# EAGLE schematic Trial_1_ECE411_Group_15_UPDATED (1) (EAGLE 9.2.1)
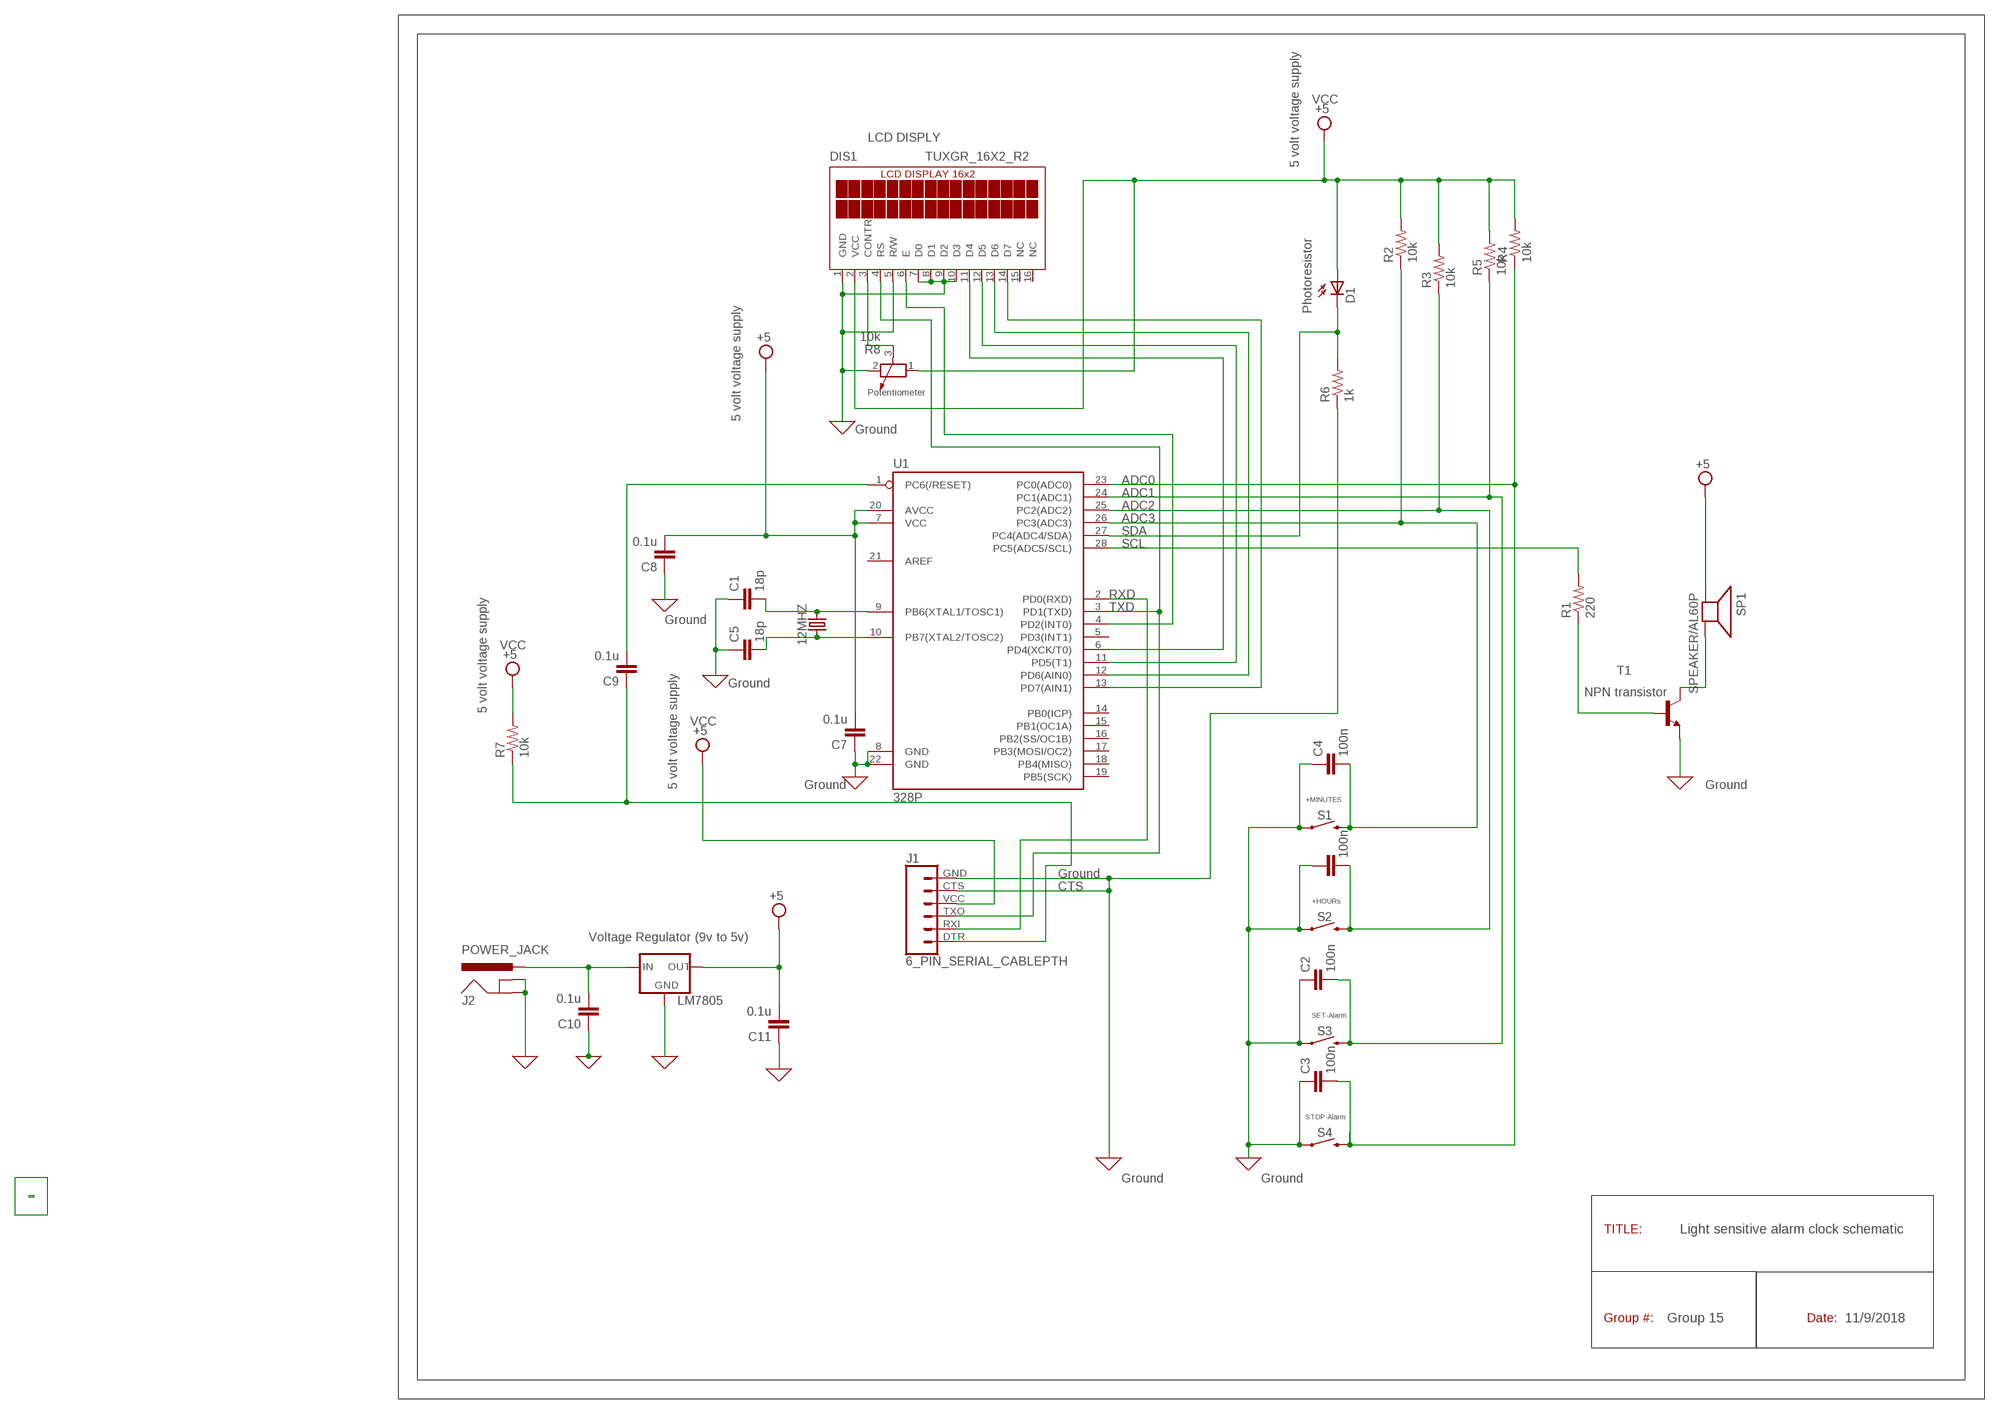
[diagram p0: schematic, sheet 1]

## Parts
12MHZ  CRYSTALPTH-2X6  [CRYSTAL-PTH-2X6-CYL]
C1  18p  C2,5-3  [C2.5-3]
C2  100n  C2,5-3  [C2.5-3]
C3  100n  C2,5-3  [C2.5-3]
C4  100n  C2,5-3  [C2.5-3]
C5  18p  C2,5-3  [C2.5-3]
C6  100n  C2,5-3  [C2.5-3]
C7  0.1u  C2,5-3  [C2.5-3]
C8  0.1u  C2,5-3  [C2.5-3]
C9  0.1u  C2,5-3  [C2.5-3]
C10  0.1u  C2,5-3  [C2.5-3]
C11  0.1u  C2,5-3  [C2.5-3]
D1  BPW32  [BPW32]
DIS1  TUXGR_16X2_R2  [TUXGR_16X2_R2]
J1  6_PIN_SERIAL_CABLEPTH  [FTDI_BASIC]
J2  POWER_JACK  [POWER_JACK_PTH]
LM7805  R-78E5.0-1.0  [DC-DC_CONVERTER_78XX]
R1  220  R-US_0204/2V  [0204V]
R2  10k  R-US_0204/2V  [0204V]
R3  10k  R-US_0204/2V  [0204V]
R4  10k  R-US_0204/2V  [0204V]
R5  10k  R-US_0204/2V  [0204V]
R6  1k  R-US_0204/2V  [0204V]
R7  10k  R-US_0204/2V  [0204V]
R8  10k  POTENTIOMETER_PT-10  [PT-10]
S1  MOMENTARY-SWITCH-SPST-PTH-6.0MM  [TACTILE_SWITCH_PTH_6.0MM]
S2  MOMENTARY-SWITCH-SPST-PTH-6.0MM  [TACTILE_SWITCH_PTH_6.0MM]
S3  MOMENTARY-SWITCH-SPST-PTH-6.0MM  [TACTILE_SWITCH_PTH_6.0MM]
S4  MOMENTARY-SWITCH-SPST-PTH-6.0MM  [TACTILE_SWITCH_PTH_6.0MM]
SP1  SPEAKER/AL60P  [AL60P]
T1  2N2222  [TO92-EBC-OVAL]
U1  328P  ATMEGA328P_PDIP  [DIP28]

## Nets
0: C1.1 C2.1 C3.1 C4.1 C5.1 C6.1 C7.1 C8.1 C10.1 C11.1 DIS1.1(GND) DIS1.5(R/W) DIS1.7(D0) DIS1.8(D1) DIS1.9(D2) DIS1.10(D3) J1.CTS J1.GND J2.GND J2.GNDBREAK LM7805.GND R6.1 R8.2 S1.1 S2.1 S3.1 S4.1 T1.E U1.8(GND) U1.22(GND) ; supply symbol labelled GND
ADC0: C3.2 R4.1 S4.3 U1.23(PC0(ADC0))
ADC1: C2.2 R5.1 S3.3 U1.24(PC1(ADC1))
ADC2: C6.2 R3.1 S2.3 U1.25(PC2(ADC2))
ADC3: C4.2 R2.1 S1.3 U1.26(PC3(ADC3))
N$1: 12MHZ.2 C1.2 U1.9(PB6(XTAL1/TOSC1))
N$2: 12MHZ.1 C5.2 U1.10(PB7(XTAL2/TOSC2))
N$3: SP1.2(-) T1.C
N$4: R1.1 T1.B
N$6: C10.2 J2.PWR LM7805.VIN(IN)
N$7: J1.RXI U1.2(PD0(RXD))
N$9: DIS1.4(RS) J1.TXO U1.3(PD1(TXD))
N$11: DIS1.3(CONTR) R8.3
N$13: DIS1.11(D4) U1.6(PD4(XCK/T0))
N$14: DIS1.12(D5) U1.11(PD5(T1))
N$15: DIS1.13(D6) U1.12(PD6(AIN0))
N$16: DIS1.14(D7) U1.13(PD7(AIN1))
N$17: D1.K(C) R6.2 U1.27(PC4(ADC4/SDA))
N$18: R1.2 U1.28(PC5(ADC5/SCL))
N$20: C9.1 J1.DTR R7.1
N$23: DIS1.6(E) U1.4(PD2(INT0))
N$24: C9.2 U1.1(PC6(/RESET))
VCC: C7.2 C8.2 C11.2 D1.A DIS1.2(VCC) J1.VCC LM7805.VOUT(OUT) R2.2 R3.2 R4.2 R5.2 R7.2 R8.1 SP1.1(+) U1.7(VCC) U1.20(AVCC) ; supply symbol labelled +5
Unconnected: DIS1.15(NC) DIS1.16(NC) U1.5(PD3(INT1)) U1.14(PB0(ICP)) U1.15(PB1(OC1A)) U1.16(PB2(SS/OC1B)) U1.17(PB3(MOSI/OC2)) U1.18(PB4(MISO)) U1.19(PB5(SCK)) U1.21(AREF)

## Notes on the sheet
- VCC
- LCD DISPLY
- 5 volt voltage supply
- Photoresistor
- Potentiometer
- 5 volt voltage supply
- Ground
- ADC0
- ADC1
- ADC2
- ADC3
- SDA
- SCL
- RXD
- TXD
- Ground
- VCC
- Ground | NPN transistor
- 5 volt voltage supply
- VCC
- 5 volt voltage supply | Ground | Ground
- +MINUTES
- Ground
- CTS
- +HOURs
- Voltage Regulator (9v to 5v)
- SET-Alarm
- STOP-Alarm
- Ground | Ground
- TITLE: | Light sensitive alarm clock schematic
- Group #: | Group 15 | Date: | 11/9/2018

## Library data of the parts
12MHZ = SparkFun-Clocks:CRYSTAL: Crystals (Generic) These are passive quartz crystals, which can be used as a clock source for a microcontroller. Crystal's are two-terminal devices. They require external "load" capacitors to generate an oscillating signal.
C1-C11 = capacitor-wima:C: CAPACITOR naming: grid - package width
D1 = opto-trans-siemens:BPW32: PHOTO DIODE; OC_FARNELL: unknown; OC_NEWARK: unknown
DIS1 = display-lcd:TUXGR_16X2_R2: Tuxgraphics LCD display 16x2 characters reflective, without background light Source: tuxgr_12x2_r2.pdf; OC_FARNELL: unknown; OC_NEWARK: unknown
J1 = SparkFun-Connectors:6_PIN_SERIAL_CABLE: 6-pin header connection for use with the "FTDI BASIC" pinout - CABLE SIDE. Also known as "Arduino Serial Program Header". This is used on a design to provide a 6-pin connection point for serial communication usually from a USB cable (D+/D-) to these headers (RX/TX). It also has the remaining pins necessary for programming in the Arduino evironment (DTR, GND, and sometimes VCC). Note, this device has "CABLE" in the name. It is intended to be used on a design that usually lives on the end of your USB cable and prvides the converter chip (FTDI232 or FTDI231x) to commnicate serial RX/TX. The "sister" device, named "TARGET" is inteneded to be used on a design that contains a target micro-controller that you wish to program. You can populate with some of these: Female Headers <https://www.sparkfun.com/products/115> (PRT-00115) For reference (or to suit your programming needs) check out these designs: SparkFun FTDI Basic Breakout - 5V <https://www.sparkfun.com/products/9716> (DEV-09716) SparkFun FTDI Basic Breakout - 3.3V <https://www.sparkfun.com/products/9873> (DEV-09873) SparkFun FTDI SmartBasic <https://www.sparkfun.com/products/12935> (DEV-12935) SparkFun Beefy 3 - FTDI Basic Breakout <https://www.sparkfun.com/products/13746> (DEV-13746)
J2 = SparkFun-Connectors:POWER_JACK: Power Jack Connector This is the standard 5.5mm barrel jack for power. The PTH is the most common, proven, reliable, footprint. The Slot footprint only works if the mill layer is transmitted to the PCB fab house so be warned. Here are the connectors we sell at SparkFun: DC Barrel Power Jack/Connector <https://www.sparkfun.com/products/119> (PRT-00119) DC Barrel Power Jack/Connector (SMD) <https://www.sparkfun.com/products/12748> (PRT-12748) DC Barrel Jack Adapter - Breadboard Compatible <https://www.sparkfun.com/products/10811> (PRT-10811) It is used on this SparkFun product (and many, many others): SparkFun RedBoard - Programmed with Arduino <https://www.sparkfun.com/products/12757> (DEV-12757) Also, if you need a mating power supply or connector, please check these out: Wall Adapter Power Supply - 9VDC 650mA <https://www.sparkfun.com/products/298> (TOL-00298) DC Barrel Jack Adapter - Male <https://www.sparkfun.com/products/10287> (PRT-10287); PROD_ID: CONN-08197
LM7805 = SparkFun-IC-Power:R-78E5.0-1.0: Recom Power 5V 1A DC/DC Converter The Recom R-78E5.0-X.X is a compact DC/DC converter module that is a pin for pin drop-in replacement for the LM7805 linear voltage regulator. Specifications: Input Range: 7-28V Output Voltage: 5V Output Current: 1A Max Efficiency: 91% Datasheet <https://www.recom-power.com/pdf/Innoline/R-78Exx-1.0.pdf>; PROD_ID: COM-13655
R1-R7 = rcl:R-US_: RESISTOR, American symbol; SPICEPREFIX: R
R8 = rcl:POTENTIOMETER_: Potentiometer; SPICEMODEL: POT; SPICEPREFIX: X
S1-S4 = SparkFun-Switches:MOMENTARY-SWITCH-SPST: Momentary Switch (Pushbutton) - SPST Normally-open (NO) SPST momentary switches (buttons, pushbuttons). Variants PTH-12MM - 12mm square, through-hole Momentary Pushbutton Switch - 12mm Square <https://www.sparkfun.com/products/9190> (COM-09190) PTH-6.0MM, PTH-6.0MM-KIT - 6.0mm square, through-hole Mini Pushbutton Switch <https://www.sparkfun.com/products/97> (COM-00097) KIT package intended for soldering kit's - only one side of pads' copper is exposed. PTH-RIGHT-ANGLE-KIT - Right-angle, through-hole Right Angle Tactile Button <https://www.sparkfun.com/products/10791> - Used on SparkFun BigTime Watch Kit <https://www.sparkfun.com/products/11734> SMD-12MM - 12mm square, surface-mount Tactile Button - SMD (12mm) <https://www.sparkfun.com/products/12993> (COM-12993) Used on SparkFun PicoBoard <https://www.sparkfun.com/products/11888> SMD-4.5MM - 4.5mm Square Trackball Switch Used on SparkFun Blackberry Trackballer Breakout <https://www.sparkfun.com/products/13169> SMD-4.6MMX2.8MM - 4.60mm x 2.80mm, surface mount Used on SparkFun SAMD21 Mini Breakout <https://www.sparkfun.com/products/13664> SMD-5.2MM, SMD-5.2-REDUNDANT - 5.2mm square, surface-mount Mini Pushbutton Switch - SMD <https://www.sparkfun.com/products/8720> (COM-08720) Used on Arduino Pro Mini <https://www.sparkfun.com/products/11114> REDUNDANT package connects both switch circuits together SMD-6.0X3.5MM - 6.0 x 3.5mm, surface mount Momentary Reset Switch SMD <https://www.sparkfun.com/products/8229> (COM-08229) SMD-6.2MM-TALL - 6.2mm square, surface mount Tactile Button - SMD (6mm) <https://www.sparkfun.com/products/12992> Used on SparkFun Digital Sandbox <https://www.sparkfun.com/products/12651> SMD-RIGHT-ANGLE - Right-angle, surface mount Used on SparkFun Block for Intel® Edison - Arduino <https://www.sparkfun.com/products/13036>; PROD_ID: SWCH-08441; SF_SKU: COM-00097
SP1 = adafruit:SPEAKER: SPEAKER Source: Buerklin Added PS12 (for part # PS1240 piezo) http://www.ladyada.net/library/pcb/eaglelibrary.html
T1 = adafruit:2N2222: NPN TRANSISTOR Big oval pads
U1 = SparkFun-IC-Microcontroller:ATMEGA328P_PDIP: Atmel 328P Through hole ATMEGA328P uC used in the Arduino 32kb flash, 1k EEPROM, 2k SRAM Datasheet <http://www.sparkfun.com/datasheets/Components/SMD/ATMega328.pdf> SparkFun Products Storefront component: AVR 28 Pin 20MHz 32K 6A/D - ATMega328P <https://www.sparkfun.com/products/9061> (COM-09061) SparkFun Simon Says - Through-Hole Soldering Kit <https://www.sparkfun.com/products/10547> (KIT-10547) SparkFun Learn to Solder - Simon Says <https://www.sparkfun.com/products/13708> (KIT-13708) SparkFun BigTime Watch Kit <https://www.sparkfun.com/products/11734> (KIT-11734) SparkFun ClockIt <https://www.sparkfun.com/products/10930> (KIT-10930) SparkFun Serial Enabled LCD Kit <https://www.sparkfun.com/products/10097> (LCD-10097) SparkFun Simon Tilts - Through Hole Soldering Kit <https://www.sparkfun.com/products/12634> (KIT-12634) SparkFun Frequency Counter Kit <https://www.sparkfun.com/products/10140> (KIT-10140) FabFM Radio Kit <https://www.sparkfun.com/products/11043> (KIT-11043) SparkFun Binary Blaster Kit <https://www.sparkfun.com/products/12037> (KIT-12037) SparkFun Metro-Gnome <https://www.sparkfun.com/products/9236> (KIT-09236) ATmega328 with Arduino Optiboot (Uno) <https://www.sparkfun.com/products/10524> (DEV-10524); PROD_ID: IC-09136